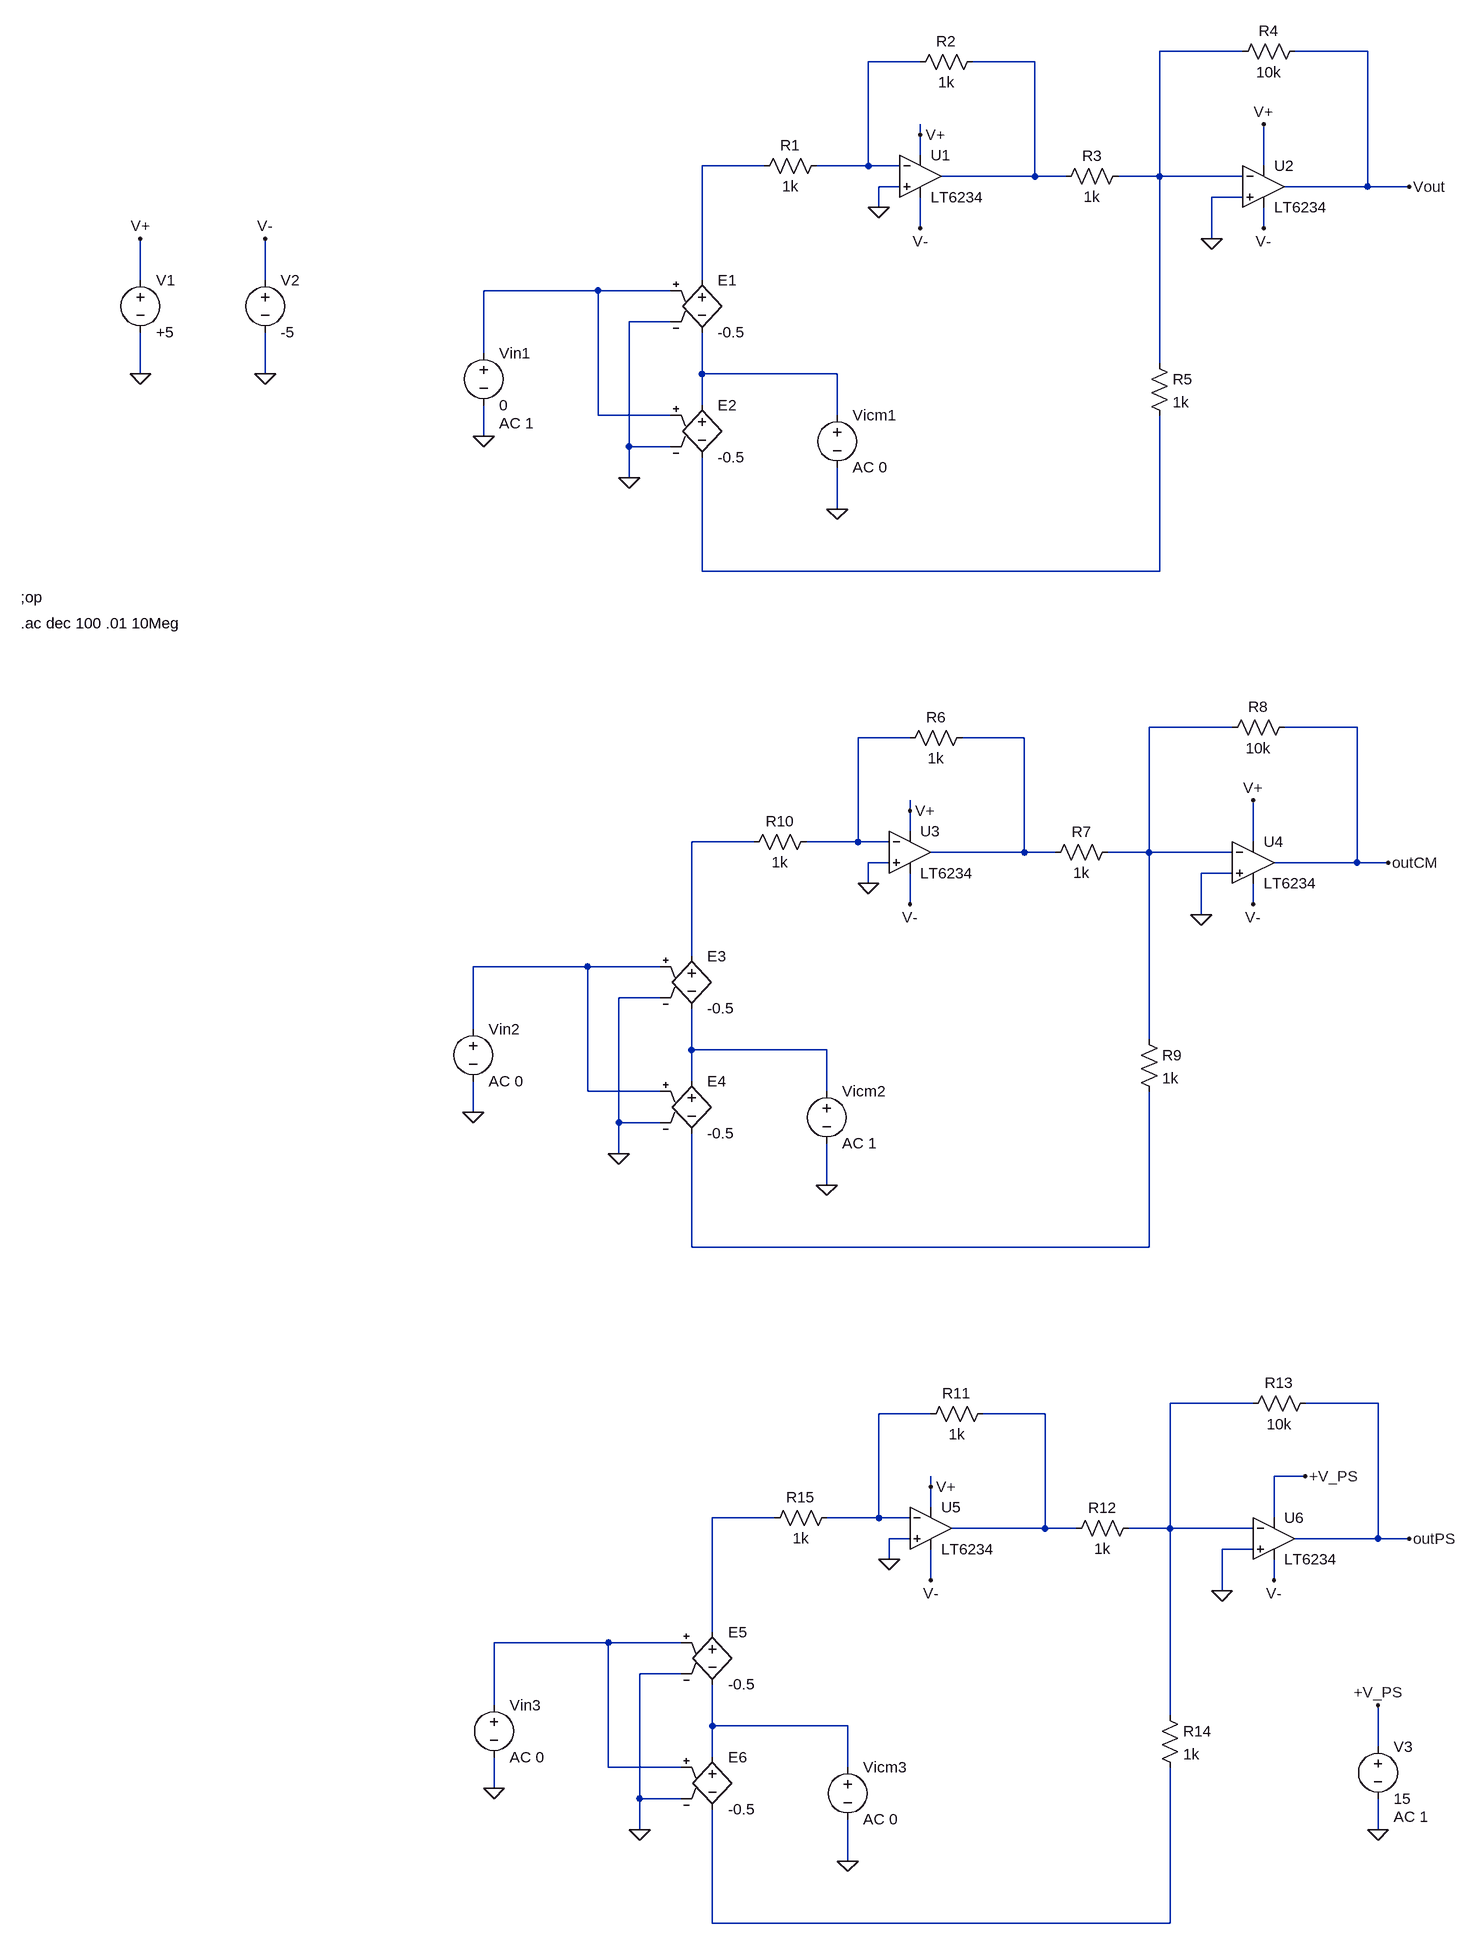
[diagram p0: schematic ETAJUL1_AI_AC.asc]
ETAJUL1_AI_AC.asc, the LTspice schematic file:
Version 4
SHEET 1 1768 2452
WIRE 1328 -432 1200 -432
WIRE 1520 -432 1408 -432
WIRE 832 -416 752 -416
WIRE 1008 -416 912 -416
WIRE 832 -304 832 -320
WIRE 832 -272 832 -304
WIRE 592 -256 496 -256
WIRE 752 -256 752 -416
WIRE 752 -256 672 -256
WIRE 800 -256 752 -256
WIRE 1360 -256 1360 -320
WIRE 1008 -240 1008 -416
WIRE 1008 -240 864 -240
WIRE 1056 -240 1008 -240
WIRE 1200 -240 1200 -432
WIRE 1200 -240 1136 -240
WIRE 1328 -240 1200 -240
WIRE 800 -224 768 -224
WIRE 1520 -224 1520 -432
WIRE 1520 -224 1392 -224
WIRE 1584 -224 1520 -224
WIRE 1328 -208 1280 -208
WIRE 768 -192 768 -224
WIRE 832 -160 832 -208
WIRE 1360 -160 1360 -192
WIRE 1280 -144 1280 -208
WIRE -368 -80 -368 -144
WIRE -176 -80 -176 -144
WIRE 496 -80 496 -256
WIRE 336 -64 160 -64
WIRE 448 -64 336 -64
WIRE 448 -16 384 -16
WIRE 160 32 160 -64
WIRE 1200 48 1200 -240
WIRE -368 64 -368 0
WIRE -176 64 -176 0
WIRE 496 64 496 0
WIRE 704 64 496 64
WIRE 496 112 496 64
WIRE 336 128 336 -64
WIRE 448 128 336 128
WIRE 704 128 704 64
WIRE 160 160 160 112
WIRE 384 176 384 -16
WIRE 448 176 384 176
WIRE 384 224 384 176
WIRE 704 272 704 208
WIRE 496 368 496 192
WIRE 1200 368 1200 128
WIRE 1200 368 496 368
WIRE 1312 608 1184 608
WIRE 1504 608 1392 608
WIRE 816 624 736 624
WIRE 992 624 896 624
WIRE 816 736 816 720
WIRE 816 768 816 736
WIRE 576 784 480 784
WIRE 736 784 736 624
WIRE 736 784 656 784
WIRE 784 784 736 784
WIRE 1344 784 1344 720
WIRE 992 800 992 624
WIRE 992 800 848 800
WIRE 1040 800 992 800
WIRE 1184 800 1184 608
WIRE 1184 800 1120 800
WIRE 1312 800 1184 800
WIRE 784 816 752 816
WIRE 1504 816 1504 608
WIRE 1504 816 1376 816
WIRE 1552 816 1504 816
WIRE 1312 832 1264 832
WIRE 752 848 752 816
WIRE 816 880 816 832
WIRE 1344 880 1344 848
WIRE 1264 896 1264 832
WIRE 480 960 480 784
WIRE 320 976 144 976
WIRE 432 976 320 976
WIRE 432 1024 368 1024
WIRE 144 1072 144 976
WIRE 1184 1088 1184 800
WIRE 480 1104 480 1040
WIRE 688 1104 480 1104
WIRE 480 1152 480 1104
WIRE 320 1168 320 976
WIRE 432 1168 320 1168
WIRE 688 1168 688 1104
WIRE 144 1200 144 1152
WIRE 368 1216 368 1024
WIRE 432 1216 368 1216
WIRE 368 1264 368 1216
WIRE 688 1312 688 1248
WIRE 480 1408 480 1232
WIRE 1184 1408 1184 1168
WIRE 1184 1408 480 1408
WIRE 1344 1648 1216 1648
WIRE 1536 1648 1424 1648
WIRE 848 1664 768 1664
WIRE 1024 1664 928 1664
WIRE 1424 1760 1376 1760
WIRE 848 1776 848 1760
WIRE 848 1808 848 1776
WIRE 608 1824 512 1824
WIRE 768 1824 768 1664
WIRE 768 1824 688 1824
WIRE 816 1824 768 1824
WIRE 1376 1824 1376 1760
WIRE 1024 1840 1024 1664
WIRE 1024 1840 880 1840
WIRE 1072 1840 1024 1840
WIRE 1216 1840 1216 1648
WIRE 1216 1840 1152 1840
WIRE 1344 1840 1216 1840
WIRE 816 1856 784 1856
WIRE 1536 1856 1536 1648
WIRE 1536 1856 1408 1856
WIRE 1584 1856 1536 1856
WIRE 1344 1872 1296 1872
WIRE 784 1888 784 1856
WIRE 848 1920 848 1872
WIRE 1376 1920 1376 1888
WIRE 1296 1936 1296 1872
WIRE 512 2000 512 1824
WIRE 352 2016 176 2016
WIRE 464 2016 352 2016
WIRE 464 2064 400 2064
WIRE 176 2112 176 2016
WIRE 1216 2128 1216 1840
WIRE 512 2144 512 2080
WIRE 720 2144 512 2144
WIRE 1536 2176 1536 2112
WIRE 512 2192 512 2144
WIRE 352 2208 352 2016
WIRE 464 2208 352 2208
WIRE 720 2208 720 2144
WIRE 176 2240 176 2192
WIRE 400 2256 400 2064
WIRE 464 2256 400 2256
WIRE 400 2304 400 2256
WIRE 1536 2304 1536 2256
WIRE 720 2352 720 2288
WIRE 512 2448 512 2272
WIRE 1216 2448 1216 2208
WIRE 1216 2448 512 2448
FLAG 768 -192 0
FLAG 1280 -144 0
FLAG -368 -144 V+
FLAG -176 -144 V-
FLAG -368 64 0
FLAG -176 64 0
FLAG 1584 -224 Vout
FLAG 832 -304 V+
FLAG 1360 -320 V+
FLAG 832 -160 V-
FLAG 1360 -160 V-
FLAG 704 272 0
FLAG 384 224 0
FLAG 160 160 0
FLAG 752 848 0
FLAG 1264 896 0
FLAG 816 736 V+
FLAG 1344 720 V+
FLAG 816 880 V-
FLAG 1344 880 V-
FLAG 688 1312 0
FLAG 368 1264 0
FLAG 144 1200 0
FLAG 784 1888 0
FLAG 1296 1936 0
FLAG 848 1776 V+
FLAG 848 1920 V-
FLAG 1376 1920 V-
FLAG 720 2352 0
FLAG 400 2304 0
FLAG 176 2240 0
FLAG 1552 816 outCM
FLAG 1584 1856 outPS
FLAG 1536 2304 0
FLAG 1424 1760 +V_PS
FLAG 1536 2112 +V_PS
DATAFLAG 1552 -224 ""
SYMBOL OpAmps\\LT6234 832 -240 R0
SYMATTR InstName U1
SYMBOL OpAmps\\LT6234 1360 -224 R0
SYMATTR InstName U2
SYMBOL res 928 -432 R90
WINDOW 0 0 56 VBottom 2
WINDOW 3 32 56 VTop 2
SYMATTR InstName R2
SYMATTR Value 1k
SYMBOL res 1152 -256 R90
WINDOW 0 0 56 VBottom 2
WINDOW 3 32 56 VTop 2
SYMATTR InstName R3
SYMATTR Value 1k
SYMBOL res 1424 -448 R90
WINDOW 0 0 56 VBottom 2
WINDOW 3 32 56 VTop 2
SYMATTR InstName R4
SYMATTR Value 10k
SYMBOL res 1184 32 R0
SYMATTR InstName R5
SYMATTR Value 1k
SYMBOL res 688 -272 R90
WINDOW 0 0 56 VBottom 2
WINDOW 3 32 56 VTop 2
SYMATTR InstName R1
SYMATTR Value 1k
SYMBOL voltage -368 -96 R0
SYMATTR InstName V1
SYMATTR Value +5
SYMBOL voltage -176 -96 R0
SYMATTR InstName V2
SYMATTR Value -5
SYMBOL voltage 704 112 R0
WINDOW 123 0 0 Left 0
WINDOW 39 0 0 Left 0
SYMATTR InstName Vicm1
SYMATTR Value AC 0
SYMBOL e 496 -96 R0
SYMATTR InstName E1
SYMATTR Value -0.5
SYMBOL e 496 96 R0
SYMATTR InstName E2
SYMATTR Value -0.5
SYMBOL voltage 160 16 R0
WINDOW 123 24 124 Left 2
WINDOW 39 0 0 Left 0
SYMATTR Value2 AC 1
SYMATTR InstName Vin1
SYMATTR Value 0
SYMBOL OpAmps\\LT6234 816 800 R0
SYMATTR InstName U3
SYMBOL OpAmps\\LT6234 1344 816 R0
SYMATTR InstName U4
SYMBOL res 912 608 R90
WINDOW 0 0 56 VBottom 2
WINDOW 3 32 56 VTop 2
SYMATTR InstName R6
SYMATTR Value 1k
SYMBOL res 1136 784 R90
WINDOW 0 0 56 VBottom 2
WINDOW 3 32 56 VTop 2
SYMATTR InstName R7
SYMATTR Value 1k
SYMBOL res 1408 592 R90
WINDOW 0 0 56 VBottom 2
WINDOW 3 32 56 VTop 2
SYMATTR InstName R8
SYMATTR Value 10k
SYMBOL res 1168 1072 R0
SYMATTR InstName R9
SYMATTR Value 1k
SYMBOL res 672 768 R90
WINDOW 0 0 56 VBottom 2
WINDOW 3 32 56 VTop 2
SYMATTR InstName R10
SYMATTR Value 1k
SYMBOL voltage 688 1152 R0
WINDOW 123 0 0 Left 0
WINDOW 39 0 0 Left 0
SYMATTR InstName Vicm2
SYMATTR Value AC 1
SYMBOL e 480 944 R0
SYMATTR InstName E3
SYMATTR Value -0.5
SYMBOL e 480 1136 R0
SYMATTR InstName E4
SYMATTR Value -0.5
SYMBOL voltage 144 1056 R0
SYMATTR InstName Vin2
SYMATTR Value AC 0
SYMBOL OpAmps\\LT6234 848 1840 R0
SYMATTR InstName U5
SYMBOL OpAmps\\LT6234 1376 1856 R0
SYMATTR InstName U6
SYMBOL res 944 1648 R90
WINDOW 0 0 56 VBottom 2
WINDOW 3 32 56 VTop 2
SYMATTR InstName R11
SYMATTR Value 1k
SYMBOL res 1168 1824 R90
WINDOW 0 0 56 VBottom 2
WINDOW 3 32 56 VTop 2
SYMATTR InstName R12
SYMATTR Value 1k
SYMBOL res 1440 1632 R90
WINDOW 0 0 56 VBottom 2
WINDOW 3 32 56 VTop 2
SYMATTR InstName R13
SYMATTR Value 10k
SYMBOL res 1200 2112 R0
SYMATTR InstName R14
SYMATTR Value 1k
SYMBOL res 704 1808 R90
WINDOW 0 0 56 VBottom 2
WINDOW 3 32 56 VTop 2
SYMATTR InstName R15
SYMATTR Value 1k
SYMBOL voltage 720 2192 R0
WINDOW 123 0 0 Left 0
WINDOW 39 0 0 Left 0
SYMATTR InstName Vicm3
SYMATTR Value AC 0
SYMBOL e 512 1984 R0
SYMATTR InstName E5
SYMATTR Value -0.5
SYMBOL e 512 2176 R0
SYMATTR InstName E6
SYMATTR Value -0.5
SYMBOL voltage 176 2096 R0
SYMATTR InstName Vin3
SYMATTR Value AC 0
SYMBOL voltage 1536 2160 R0
WINDOW 123 24 124 Left 2
WINDOW 39 0 0 Left 0
SYMATTR Value2 AC 1
SYMATTR InstName V3
SYMATTR Value 15
TEXT -552 408 Left 2 !;op
TEXT -552 448 Left 2 !.ac dec 100 .01 10Meg

The netlist it stands for:
* ETAJUL1_AI_AC.asc
* U1: LT6234 (symbol OpAmps\LT6234 not available, pins judged from their places): In+=0 In-=N002 V+=V+ V-=V- OUT=N003
* U2: LT6234 (symbol OpAmps\LT6234 not available, pins judged from their places): In+=0 In-=N001 V+=V+ V-=V- OUT=Vout
R2 N003 N002 1k
R3 N001 N003 1k
R4 Vout N001 10k
R5 N001 N007 1k
R1 N002 N004 1k
V1 V+ 0 +5
V2 V- 0 -5
Vicm1 N006 0 AC 0
E1 N004 N006 N005 0 -0.5
E2 N006 N007 N005 0 -0.5
Vin1 N005 0 0 AC 1
* U3: LT6234 (symbol OpAmps\LT6234 not available, pins judged from their places): In+=0 In-=N009 V+=V+ V-=V- OUT=N010
* U4: LT6234 (symbol OpAmps\LT6234 not available, pins judged from their places): In+=0 In-=N008 V+=V+ V-=V- OUT=outCM
R6 N010 N009 1k
R7 N008 N010 1k
R8 outCM N008 10k
R9 N008 N014 1k
R10 N009 N011 1k
Vicm2 N013 0 AC 1
E3 N011 N013 N012 0 -0.5
E4 N013 N014 N012 0 -0.5
Vin2 N012 0 AC 0
* U5: LT6234 (symbol OpAmps\LT6234 not available, pins judged from their places): In+=0 In-=N016 V+=V+ V-=V- OUT=N017
* U6: LT6234 (symbol OpAmps\LT6234 not available, pins judged from their places): In+=0 In-=N015 V+=+V_PS V-=V- OUT=outPS
R11 N017 N016 1k
R12 N015 N017 1k
R13 outPS N015 10k
R14 N015 N021 1k
R15 N016 N018 1k
Vicm3 N020 0 AC 0
E5 N018 N020 N019 0 -0.5
E6 N020 N021 N019 0 -0.5
Vin3 N019 0 AC 0
V3 +V_PS 0 15 AC 1
;op
.ac dec 100 .01 10Meg
.backanno
.end